# EAGLE design receiver (EAGLE 9.6.2)
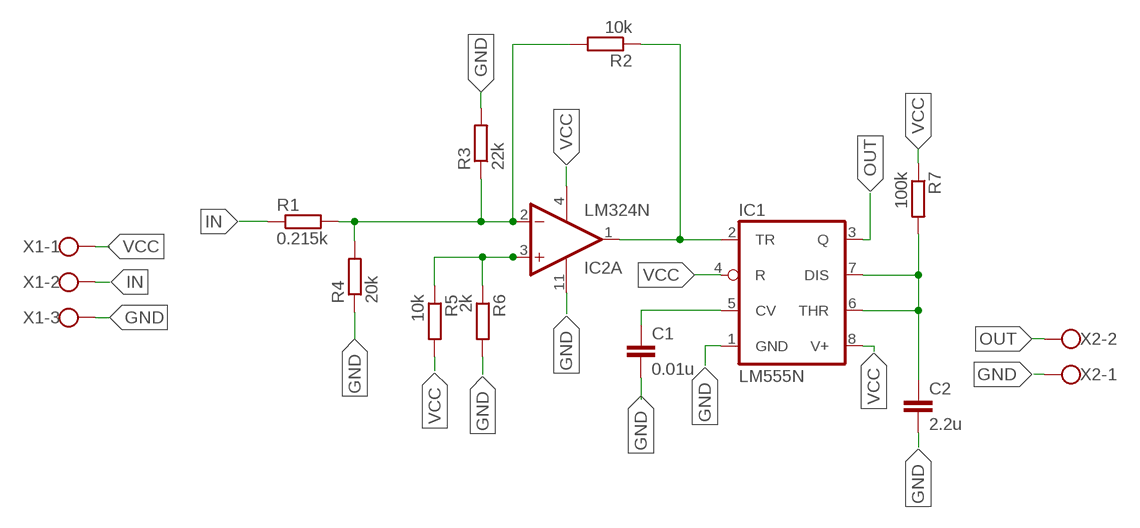
[diagram p0: schematic, sheet 1]

## Parts
C1  0.01u  C-EU050-025X075  [C050-025X075]
C2  2.2u  C-EU050-025X075  [C050-025X075]
IC1  LM555N  [DIL08]
IC2  LM324N  [DIL14]
R1  0.215k  R-EU_0207/10  [0207/10]
R2  10k  R-EU_0207/10  [0207/10]
R3  22k  R-EU_0207/10  [0207/10]
R4  20k  R-EU_0207/10  [0207/10]
R5  10k  R-EU_0207/10  [0207/10]
R6  2k  R-EU_0207/10  [0207/10]
R7  100k  R-EU_0207/10  [0207/10]
X1  W237-103  [W237-103]
X2  W237-102  [W237-102]

## Nets
GND: C1.2 C2.2 IC1.1(GND) IC2.11(P:V-) R3.2 R4.1 R6.2 X1.3 X2.1
IN: R1.1 X1.2
N$1: IC2.2(A:-IN) R1.2 R2.2 R3.1 R4.2
N$2: IC2.3(A:+IN) R5.1 R6.1
N$3: C2.1 IC1.6(THR) IC1.7(DIS) R7.2
N$4: IC1.2(TR) IC2.1(A:OUT) R2.1
N$5: C1.1 IC1.5(CV)
OUT: IC1.3(Q) X2.2
VCC: IC1.4(R) IC1.8(V+) IC2.4(P:V+) R5.2 R7.1 X1.1
Unconnected: IC2.5(B:+IN) IC2.6(B:-IN) IC2.7(B:OUT) IC2.8(C:OUT) IC2.9(C:-IN) IC2.10(C:+IN) IC2.12(D:+IN) IC2.13(D:-IN) IC2.14(D:OUT)

## Library data of the parts
C1 C2 = rcl:C-EU: CAPACITOR, European symbol; SPICEPREFIX: C
IC1 = linear:*555: TIMER
IC2 = linear:LM324: OP AMP
R1-R7 = rcl:R-EU_: RESISTOR, European symbol; SPICEPREFIX: R
X1 = con-wago-500:W237-103: WAGO SCREW CLAMP; MPN: 237-103; OC_FARNELL: unknown; OC_NEWARK: 18M7116
X2 = con-wago-500:W237-102: WAGO SCREW CLAMP; MPN: 237-102; OC_FARNELL: unknown; OC_NEWARK: 70K9898

## Board
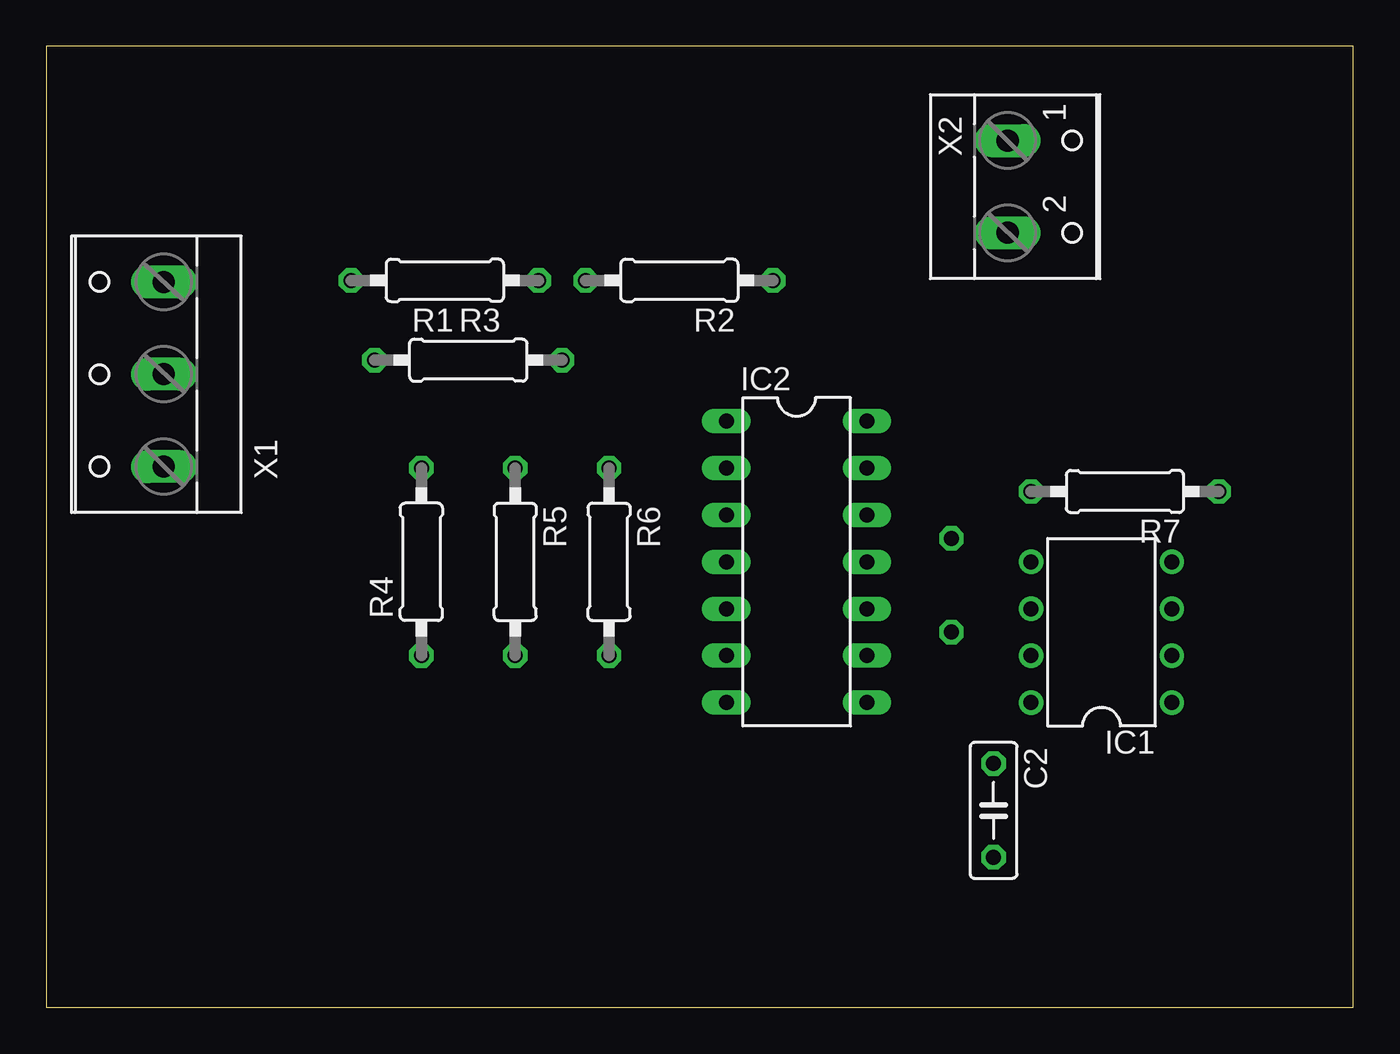
[diagram p1: board, top side]
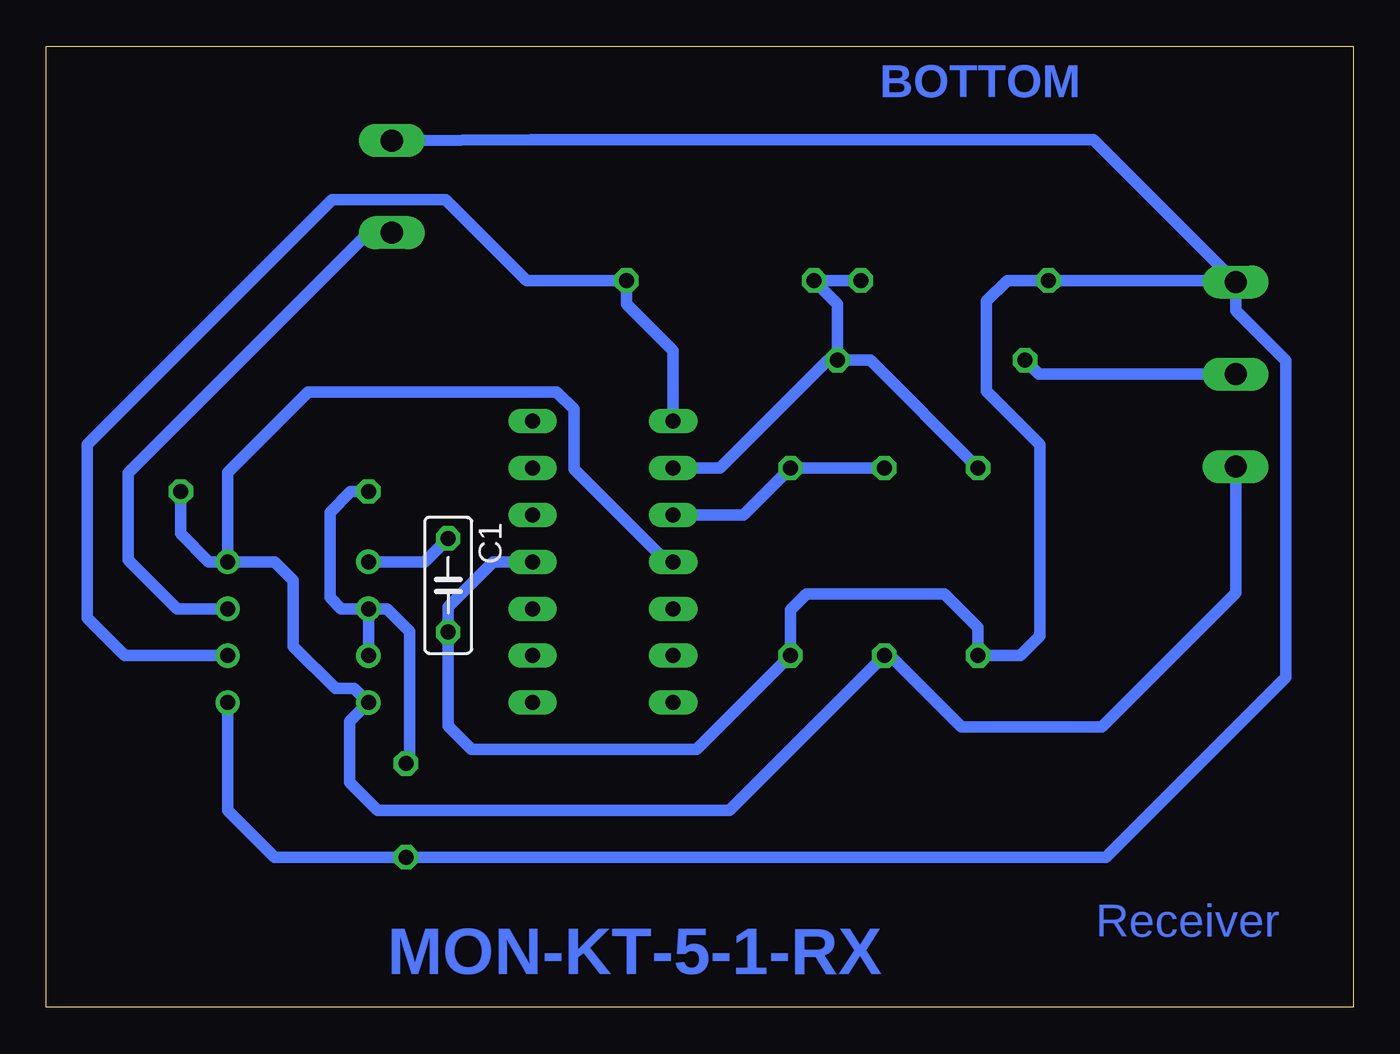
[diagram p2: board, bottom side, seen from below]

Size 70.79 x 52.06 mm. Coordinates in mm from the lower left corner, seen from the top.
Outline: 0,0 70.79,0 70.79,52.06 0,52.06 0,0
Copper layers (1*16): Top 0.035mm / dielectric 1.5mm / Bottom 0.035mm
Design rules "default *": minimum track width 24mil, minimum drill 0.35mm, track to track 24mil, track to pad 24mil, pad to pad 24mil, via to via 24mil, smd to smd 24mil, copper to edge 40mil, drill to drill 24mil, minimum pad ring 10mil, minimum via ring 8mil, stop-mask expansion 4mil, vias tented up to drill 0mil, thermal gap 10mil

### Footprints (pad centres in the part's own frame; a part is rotated, then mirrored left to right if it is on the bottom)
C050-025X075 = drill 0.813 octagon: 1 -2.54,0; 2 2.54,0
DIL08 = drill 0.813 pad 1.27: 1 -3.81,-3.81; 2 -1.27,-3.81; 3 1.27,-3.81; 4 3.81,-3.81; 5 3.81,3.81; 6 1.27,3.81; 7 -1.27,3.81; 8 -3.81,3.81
DIL14 = drill 0.813 long: 1 -7.62,-3.81; 2 -5.08,-3.81; 3 -2.54,-3.81; 4 0,-3.81; 5 2.54,-3.81; 6 5.08,-3.81; 7 7.62,-3.81; 8 7.62,3.81; 9 5.08,3.81; 10 2.54,3.81; 11 0,3.81; 12 -2.54,3.81; 13 -5.08,3.81; 14 -7.62,3.81
0207/10 = drill 0.813 octagon: 1 -5.08,0; 2 5.08,0
W237-103 = drill 1.194 long: 1 -5,-1.29; 2 0,-1.29; 3 5,-1.29
W237-102 = drill 1.194 long: 1 -2.5,-1.27; 2 2.5,-1.27

### Placement (x,y rotation side)
C1  49.02,22.86 270 bottom
C2  51.31,10.67 270 top
IC1  57.15,20.32 90 top
IC2  40.64,24.13 270 top
R1  22.86,35.05 0 top
R2  34.29,39.37 180 top
R3  21.59,39.37 180 top
R4  20.32,24.13 90 top
R5  25.4,24.13 270 top
R6  30.48,24.13 270 top
R7  58.42,27.94 180 top
X1  5.08,34.29 90 top
X2  53.34,44.45 270 top

### Tracks (layer width: path | path; a pad name or v marks a point on that pad's centre or on a via)
GND
  Bottom 0.61: 6.45,39.37 X1.3 6.37,37.75 3.67,35.04 3.67,17.87 13.41,8.13 C2.2 58.42,8.13 60.96,10.67 IC1.1 | 6.45,39.37 R3.2 18.74,39.37 19.86,38.24 19.86,33.38 16.97,30.49 16.97,20.12 18.03,19.05 R4.1 20.32,20.58 22.14,22.4 29.61,22.4 30.48,21.53 R6.2 35.56,13.97 47.75,13.97 49.02,15.24 C1.2 49.02,21.68 46.58,24.13 IC2.11 | X2.1 44.49,46.99 14.07,46.99 6.45,39.37
IN
  Bottom 0.61: X1.2 17.02,34.29 R1.1
N$1
  Bottom 0.61: R4.2 26.16,35.05 R1.2 | R1.2 28.45,35.05 34.29,29.21 IC2.2 | R3.1 R2.2 27.94,38.1 R1.2
N$2
  Bottom 0.61: R5.1 R6.1 33.02,26.67 IC2.3
N$3
  Bottom 0.61: IC1.6 IC1.7 | IC1.6 54.8,21.59 55.42,22.21 55.42,26.81 54.3,27.94 R7.2 | C2.1 51.1,13.41 51.1,20.37 52.32,21.59 IC1.6
N$4
  Bottom 0.61: IC2.1 36.83,35.56 39.37,38.1 R2.1 44.77,39.37 49.16,43.76 55.3,43.76 68.58,30.48 68.58,21.08 66.55,19.05 IC1.2
N$5
  Bottom 0.61: C1.1 50.29,24.13 IC1.5
OUT
  Bottom 0.61: X2.2 53.34,41.95 66.34,28.94 66.34,24.24 63.7,21.59 IC1.3
VCC
  Bottom 0.61: X1.1 6.37,22.43 13.61,15.19 21.23,15.19 25.09,19.05 R5.2 33.78,10.67 52.83,10.67 54.36,12.19 54.36,15.49 IC1.8 54.1,17.27 55.12,17.27 57.4,19.56 57.4,23.11 58.42,24.13 IC1.4 | IC1.4 61.98,24.13 63.5,25.65 R7.1 | IC2.4 37.18,24.13 42.22,29.17 42.22,32.4 43.14,33.33 56.59,33.33 60.96,28.96 IC1.4

### Text on the board
Bottom: BOTTOM | Receiver | MON-KT-5-1-RX